# Altium schematic sheet Flow_sensor.SchDoc
size 420 x 297 mm; Address1: Address1; Address2: Address2; Address3: Address3; Address4: Address4; DocumentNumber: *Э3; SheetNumber: 11; SheetTotal: 14; DocumentType: Схема электрическая *
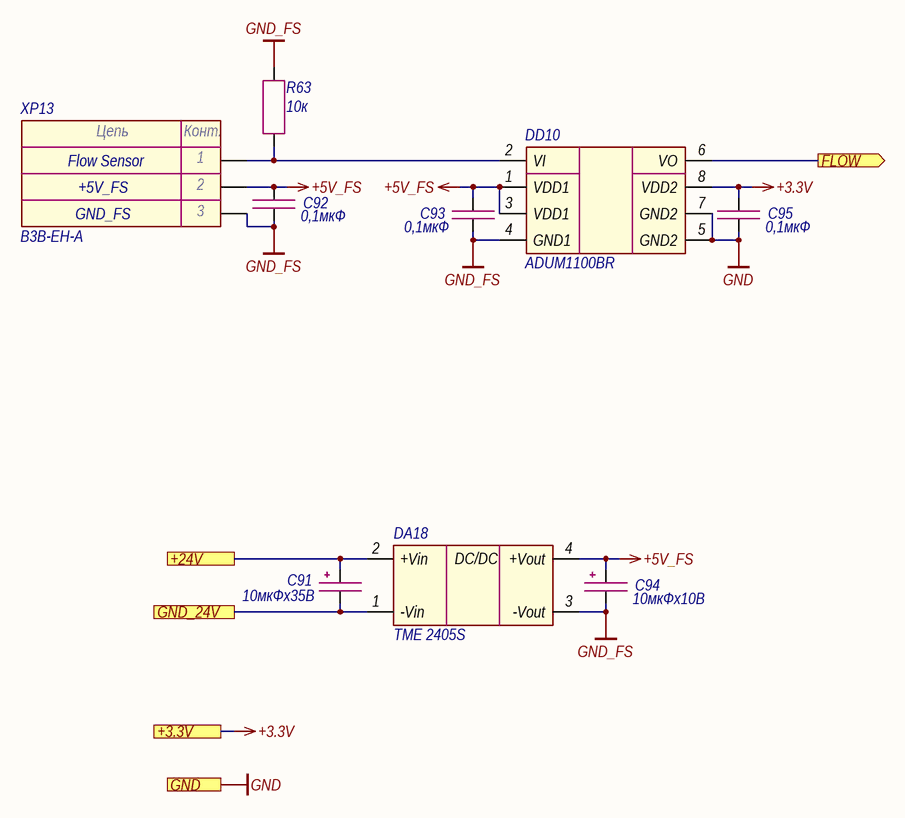
[diagram p0: Flow_sensor.SchDoc]

## Parts
C91  10мкФх35B  [CAP_C]
C92  0,1мкФ  [CAP_0603]
C93  0,1мкФ  [CAP_0603]
C94  10мкФх10B  [CAP_A]
C95  0,1мкФ  [CAP_0603]
DA18  TME 2405S  [TME (SIP-4)]
DD10  ADUM1100BR  [SOIC-8]
R63  10к  [RES_0603]
XP13  B3B-EH-A  [B3B-EH-A]

## Ports
+3.3V (see Main[1C], Button[1D], Ethernet[3D], Fiber_interlock[2C], LD_driver[1D], Power_supply[2C], RS-485[2C]), +24V (see Main[1C], Button[1C], Column[1C], Indication[1C], LD_driver[1D]), FLOW (out, see Main[1C]), GND (see Main[1C], Button[1D], Column[1C], Ethernet[3D], Fiber_interlock[2C], Guide_laser[1C], Indication[1C], LD_driver[1D], Power_supply[2C], RS-485[2C]), GND_24V (see Main[1C], Button[1D], Column[1C], Indication[1C], LD_driver[1D])

## Nets
+3.3V: C95.1 DD10.8(VDD2) ; port +3.3V
+5V_FS: C92.1 C93.1 C94.1 DA18.4(+Vout) DD10.1(VDD1) DD10.3(VDD1) XP13.2
GND: C95.2 DD10.5(GND2) DD10.7(GND2) ; port GND
GND_FS: C92.2 C93.2 C94.2 DA18.3(-Vout) DD10.4(GND1) R63.2 XP13.3
+24V: C91.1 DA18.2(+Vin) ; port +24V
FLOW: DD10.6(VO) ; port FLOW
GND_24V: C91.2 DA18.1(-Vin) ; port GND_24V
NetDD10_2: DD10.2(VI) R63.1 XP13.1

## Notes on the sheet
- +5V_FS
- Flow Sensor
- GND_FS
- Подп. и дата
- Инв. № дубл.
- Взам. инв. №
- Инв. № подл.
- Изм.
- Лист
- № докум.
- Подп.
- Дата
- Копировал
- Формат А3
- (in symbol Connector-3) Цепь; Конт.
- (in symbol TME) DC/DC

## Library data of the parts
C91 = Capacitor_Polar: Model: TECAP, 10 мкФ, 35 В, тип C, 10%; Value: 10мкФх35B; Document: *; Manufacturer: *
C92 C93 C95 = Capacitor: Manufacturer: Murata; Model: GRM188R71H104KA93D; Value: 0,1мкФ; Document: *
C94 = Capacitor_Polar: Model: TECAP, 10 мкФ, 10 В, тип A, 10%; Value: 10мкФх10B; Document: *; Manufacturer: *
DA18 = TME: Manufacturer: Traco Power; Model: TME 2405S; Document: *
DD10 = ADUM1100: Manufacturer: Analog Devices; Model: ADUM1100BR; Document: *
R63 = Resistor: Manufacturer: Yageo; Model: RC0603FR-0710KL; Value: 10к; Document: *
XP13 = Connector-3: Manufacturer: JST; Model: B3B-EH-A; Document: *